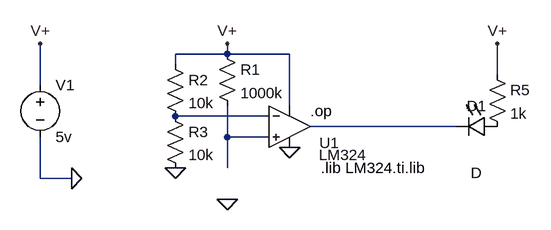
[diagram p0: schematic water sensor.asc]
water sensor.asc, the LTspice schematic file:
Version 4
SHEET 1 880 680
WIRE 208 32 208 16
WIRE 208 32 128 32
WIRE 304 32 208 32
WIRE 128 48 128 32
WIRE 624 64 624 16
WIRE -80 80 -80 16
WIRE 304 112 304 32
WIRE 272 128 128 128
WIRE 560 144 336 144
WIRE 208 160 208 112
WIRE 272 160 208 160
WIRE 208 208 208 160
WIRE -80 224 -80 160
WIRE -32 224 -80 224
FLAG 304 176 0
FLAG -32 224 0
FLAG 128 208 0
FLAG -80 16 V+
FLAG 208 16 V+
FLAG 624 16 V+
FLAG 208 256 0
DATAFLAG 240 160 ""
DATAFLAG 240 128 ""
DATAFLAG 448 144 ""
DATAFLAG 624 32 ""
SYMBOL OpAmps\\opamp2 304 80 R0
WINDOW 0 46 89 Left 2
WINDOW 3 45 108 Left 2
SYMATTR InstName U1
SYMATTR Value LM324
SYMBOL voltage -80 64 R0
WINDOW 123 0 0 Left 0
WINDOW 39 0 0 Left 0
SYMATTR InstName V1
SYMATTR Value 5v
SYMBOL res 192 16 R0
SYMATTR InstName R1
SYMATTR Value 1000k
SYMBOL res 112 32 R0
SYMATTR InstName R2
SYMATTR Value 10k
SYMBOL res 112 112 R0
SYMATTR InstName R3
SYMATTR Value 10k
SYMBOL LED 624 128 R90
WINDOW 0 0 32 VBottom 2
WINDOW 3 72 32 VTop 2
SYMATTR InstName D1
SYMBOL res 608 48 R0
SYMATTR InstName R5
SYMATTR Value 1k
TEXT 352 208 Left 2 !.lib LM324.ti.lib
TEXT 336 120 Left 2 !.op

The netlist it stands for:
* water sensor.asc
XU1 N003 N001 V+ 0 N002 LM324  ; pins In+ In- V+ V- OUT
V1 V+ 0 5v
R1 V+ N003 1000k
R2 V+ N001 10k
R3 N001 0 10k
D1 P001 N002 D
R5 V+ P001 1k
.model D D
.lib standard.dio
.lib LM324.ti.lib
.op
.backanno
.end